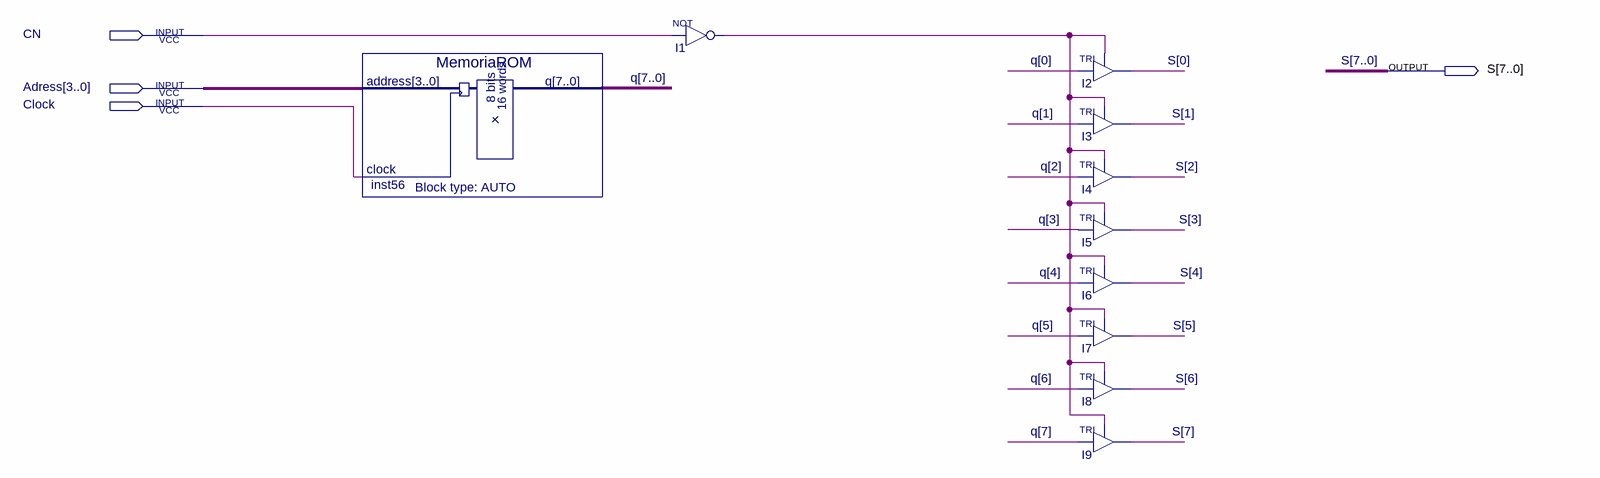
[diagram p0: schematic sheet]
// Quartus schematic Memoria.bdf as structural Verilog: 10 symbols, 4 pins
module Memoria (
  input  CN,
  input  [3:0] Adress,
  input  Clock,
  output [7:0] S
);

  wire I1_out;
  wire [7:0] q;

  MemoriaROM inst56 (.address(Adress), .clock(Clock), .q(q));
  not I1 (I1_out, CN);
  TRI I2 (.IN(q[0]), .OE(I1_out), .OUT(S[0]));
  TRI I3 (.IN(q[1]), .OE(I1_out), .OUT(S[1]));
  TRI I4 (.IN(q[2]), .OE(I1_out), .OUT(S[2]));
  TRI I5 (.IN(q[3]), .OE(I1_out), .OUT(S[3]));
  TRI I6 (.IN(q[4]), .OE(I1_out), .OUT(S[4]));
  TRI I7 (.IN(q[5]), .OE(I1_out), .OUT(S[5]));
  TRI I8 (.IN(q[6]), .OE(I1_out), .OUT(S[6]));
  TRI I9 (.IN(q[7]), .OE(I1_out), .OUT(S[7]));
endmodule
